# Altium schematic sheet Sheet1.SchDoc
size 420 x 297 mm; CheckedBy: Семенцов С. Г.; DocumentNumber: ИУ4.11.03.03.23.05.52.04.001 ПД1; SheetTotal: 1; DocumentType: Схема электрическая принципиальная; FirstReferrence: ИУ4.11.03.03.23.05.52.04.001 СП
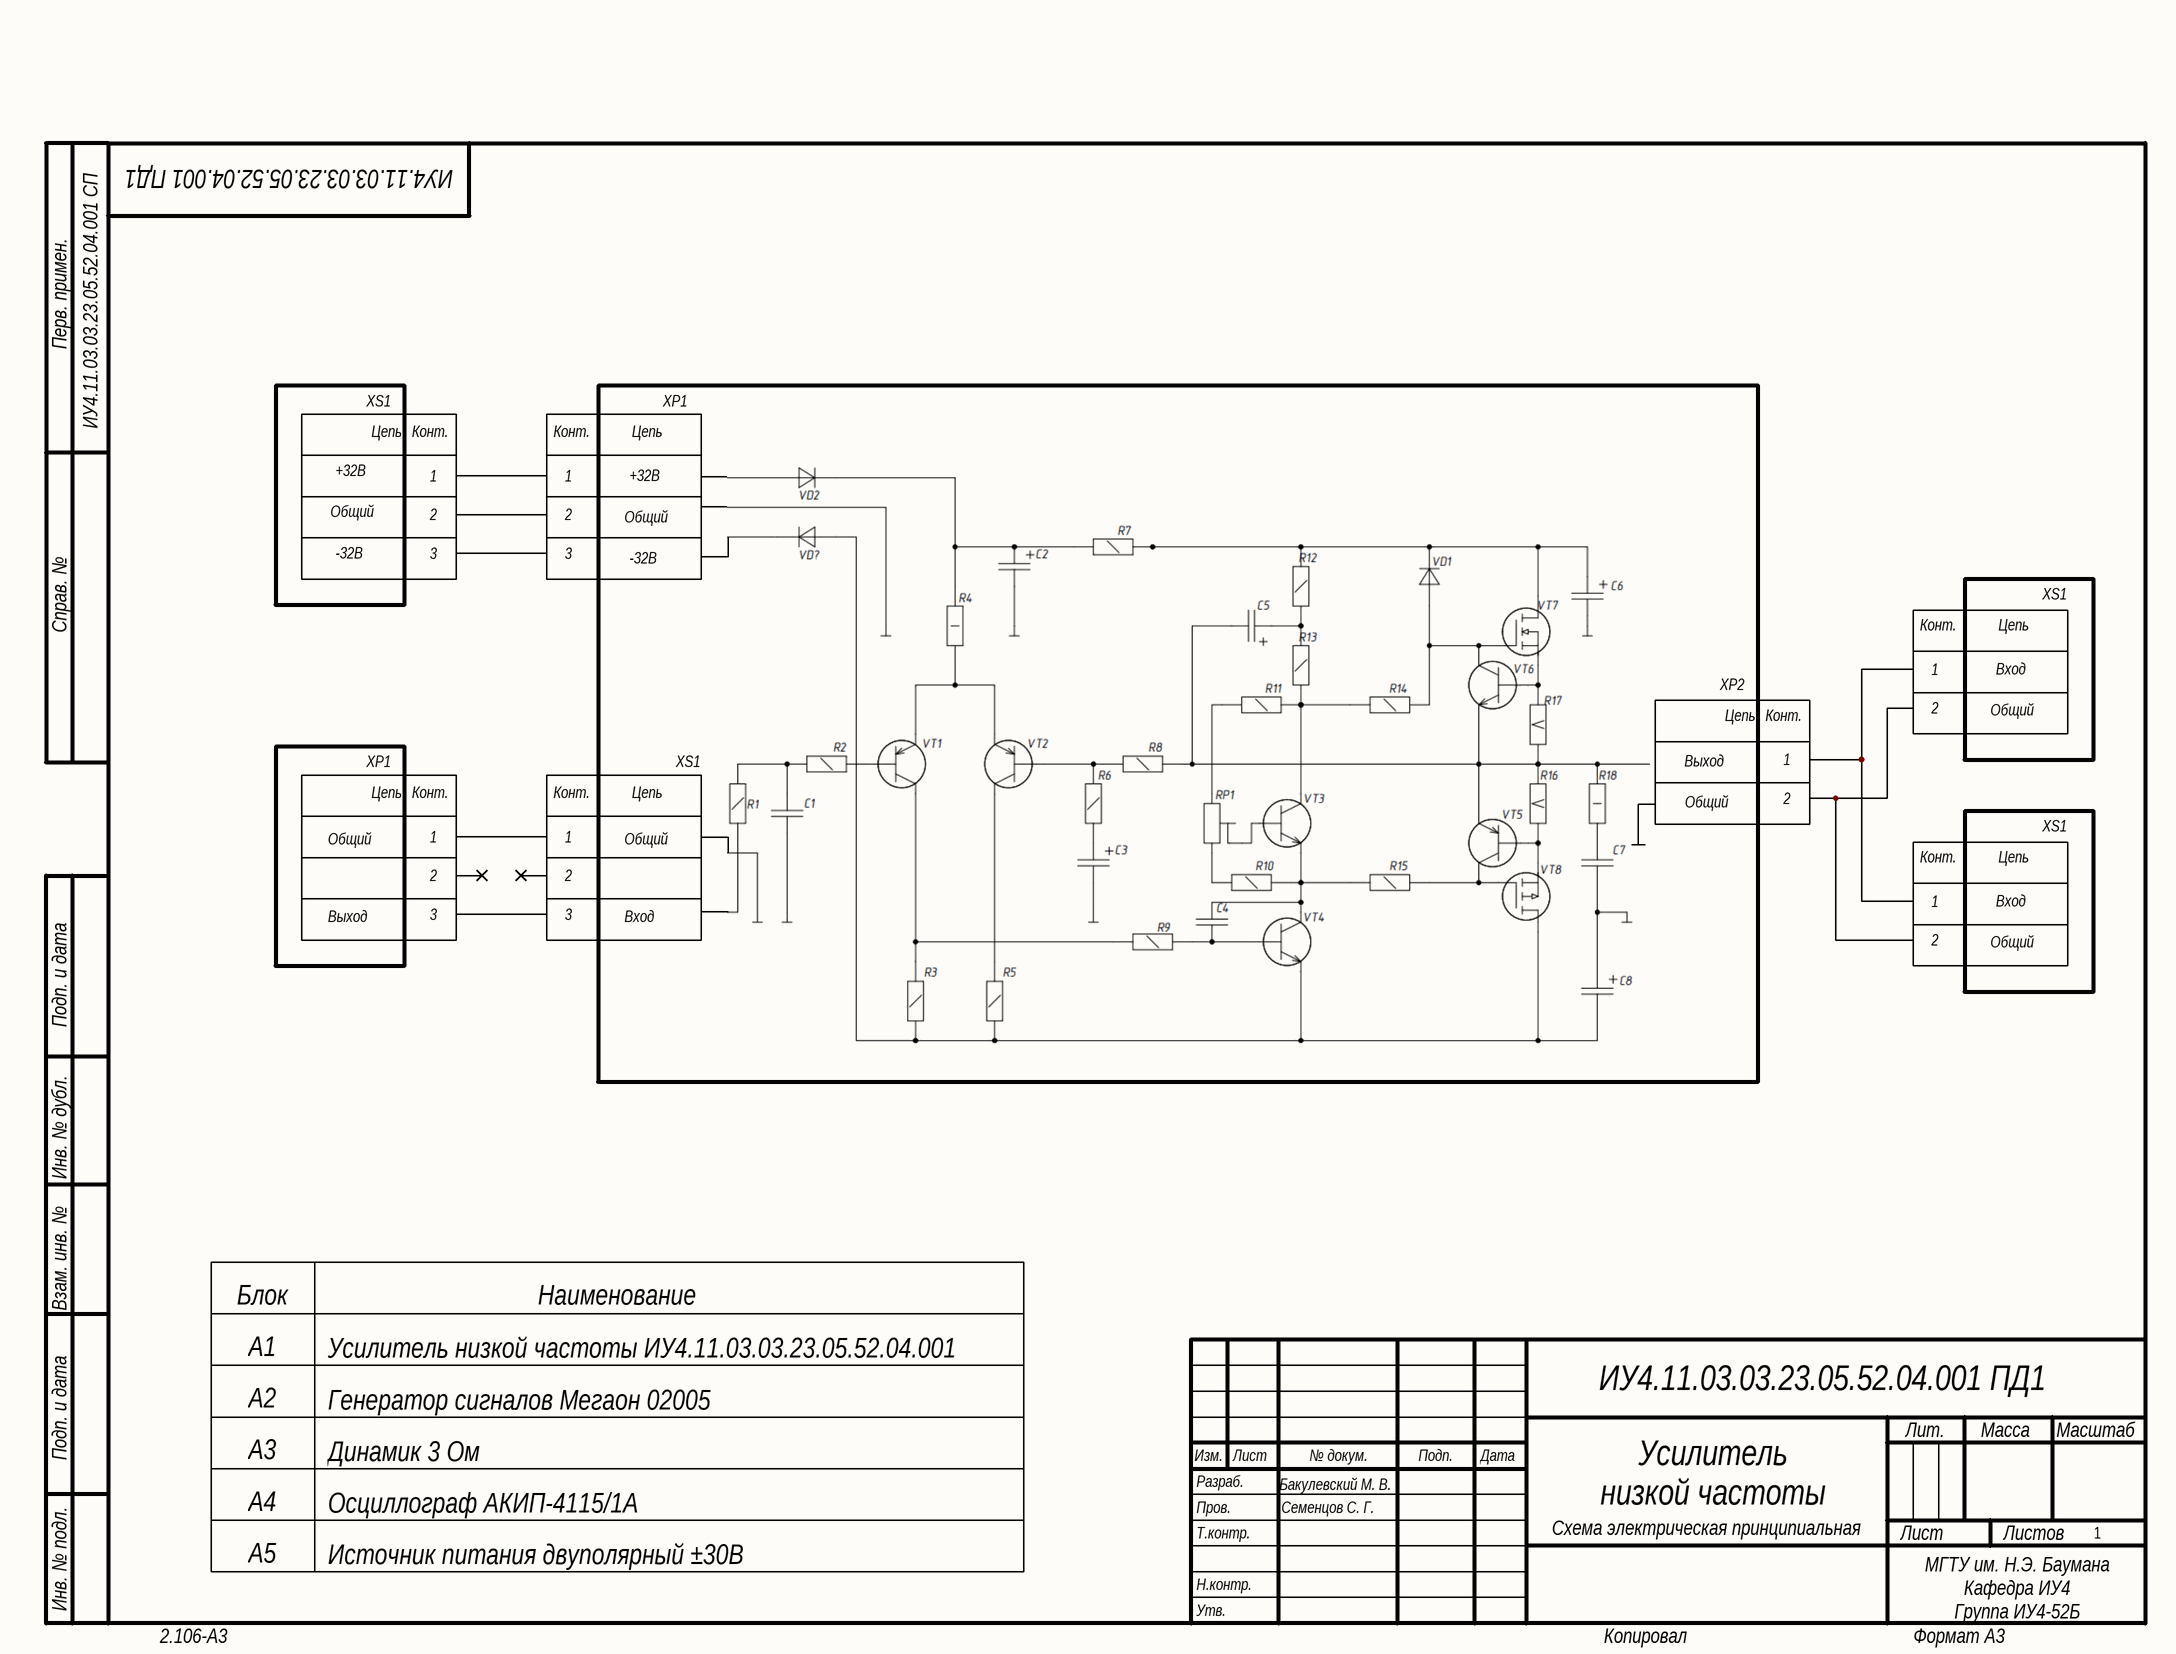
[diagram p0: Sheet1.SchDoc]

## Parts
(Parts that share a designator on the sheet are numbered #1, #2 ... from top to bottom, then left to right.)
XP1#1  Общий  [15EDGRC-3.81-03P]  (value not drawn)
XP1#2  Общий  [ST-025]  (value not drawn)
XP2  Connector Dynamic 2 pin  [15EDGRC-3.81-02P]  (value not drawn)
XS1#1  Общий  [ST-025]  (value not drawn)
XS1#2  Connector Dynamic 2 pin  [15EDGRC-3.81-02P]  (value not drawn)
XS1#3  Общий  [ST-025]  (value not drawn)
XS1#4  Connector Dynamic 2 pin  [15EDGRC-3.81-02P]  (value not drawn)

## Nets
NetXP1#1_1: XP1#1.1 XS1#1.1
NetXP1#1_2: XP1#1.2 XS1#1.2
NetXP1#1_3: XP1#1.3 XS1#1.3
NetXP1#2_1: XP1#2.1 XS1#3.1
NetXP1#2_3: XP1#2.3 XS1#3.3
NetXP2_1: XP2.1 XS1#2.1 XS1#4.1
NetXP2_2: XP2.2 XS1#2.2 XS1#4.2

Not connected (* = marked no-connect by the designer): XP1#2 2*; XS1#3 2*

## Notes on the sheet
- А5
- А2
- А1
- +32В
- Общий
- -32В
- А3
- Вход
- Выход
- А4
- Блок
- Наименование
- Усилитель низкой частоты ИУ4.11.03.03.23.05.52.04.001
- Генератор сигналов Мегаон 02005
- Динамик 3 Ом
- Осциллограф АКИП-4115/1А
- Бакулевский М. В.
- Усилитель
  низкой частоты
- Источник питания двуполярный ±30В
- МГТУ им. Н.Э. Баумана
  Кафедра ИУ4
  Группа ИУ4-52Б
- Перв. примен.
- Справ. №
- Подп. и дата
- Инв. № дубл.
- Взам. инв. №
- Разраб.
- Изм.
- Лист
- № докум.
- Подп.
- Дата
- Лит.
- Масса
- Масштаб
- Пров.
- Т.контр.
- Листов
- Инв. № подл.
- Утв.
- Н.контр.
- 2.106-A3
- Копировал
- Формат А3
- (in symbol Connector Audio 3 pin) Цепь; Конт.
- (in symbol Connector Dynamic 2 pin) Цепь; Конт.
- (in symbol Connector Power 3 pin) Конт.; Цепь

## Library data of the parts
XP1#1 = Connector Power 3 pin
XP1#2 XS1#1 XS1#3 = Connector Audio 3 pin